# Altium schematic sheet IMU.SchDoc
size 420 x 297 mm; SheetNumber: 4; SheetTotal: 7
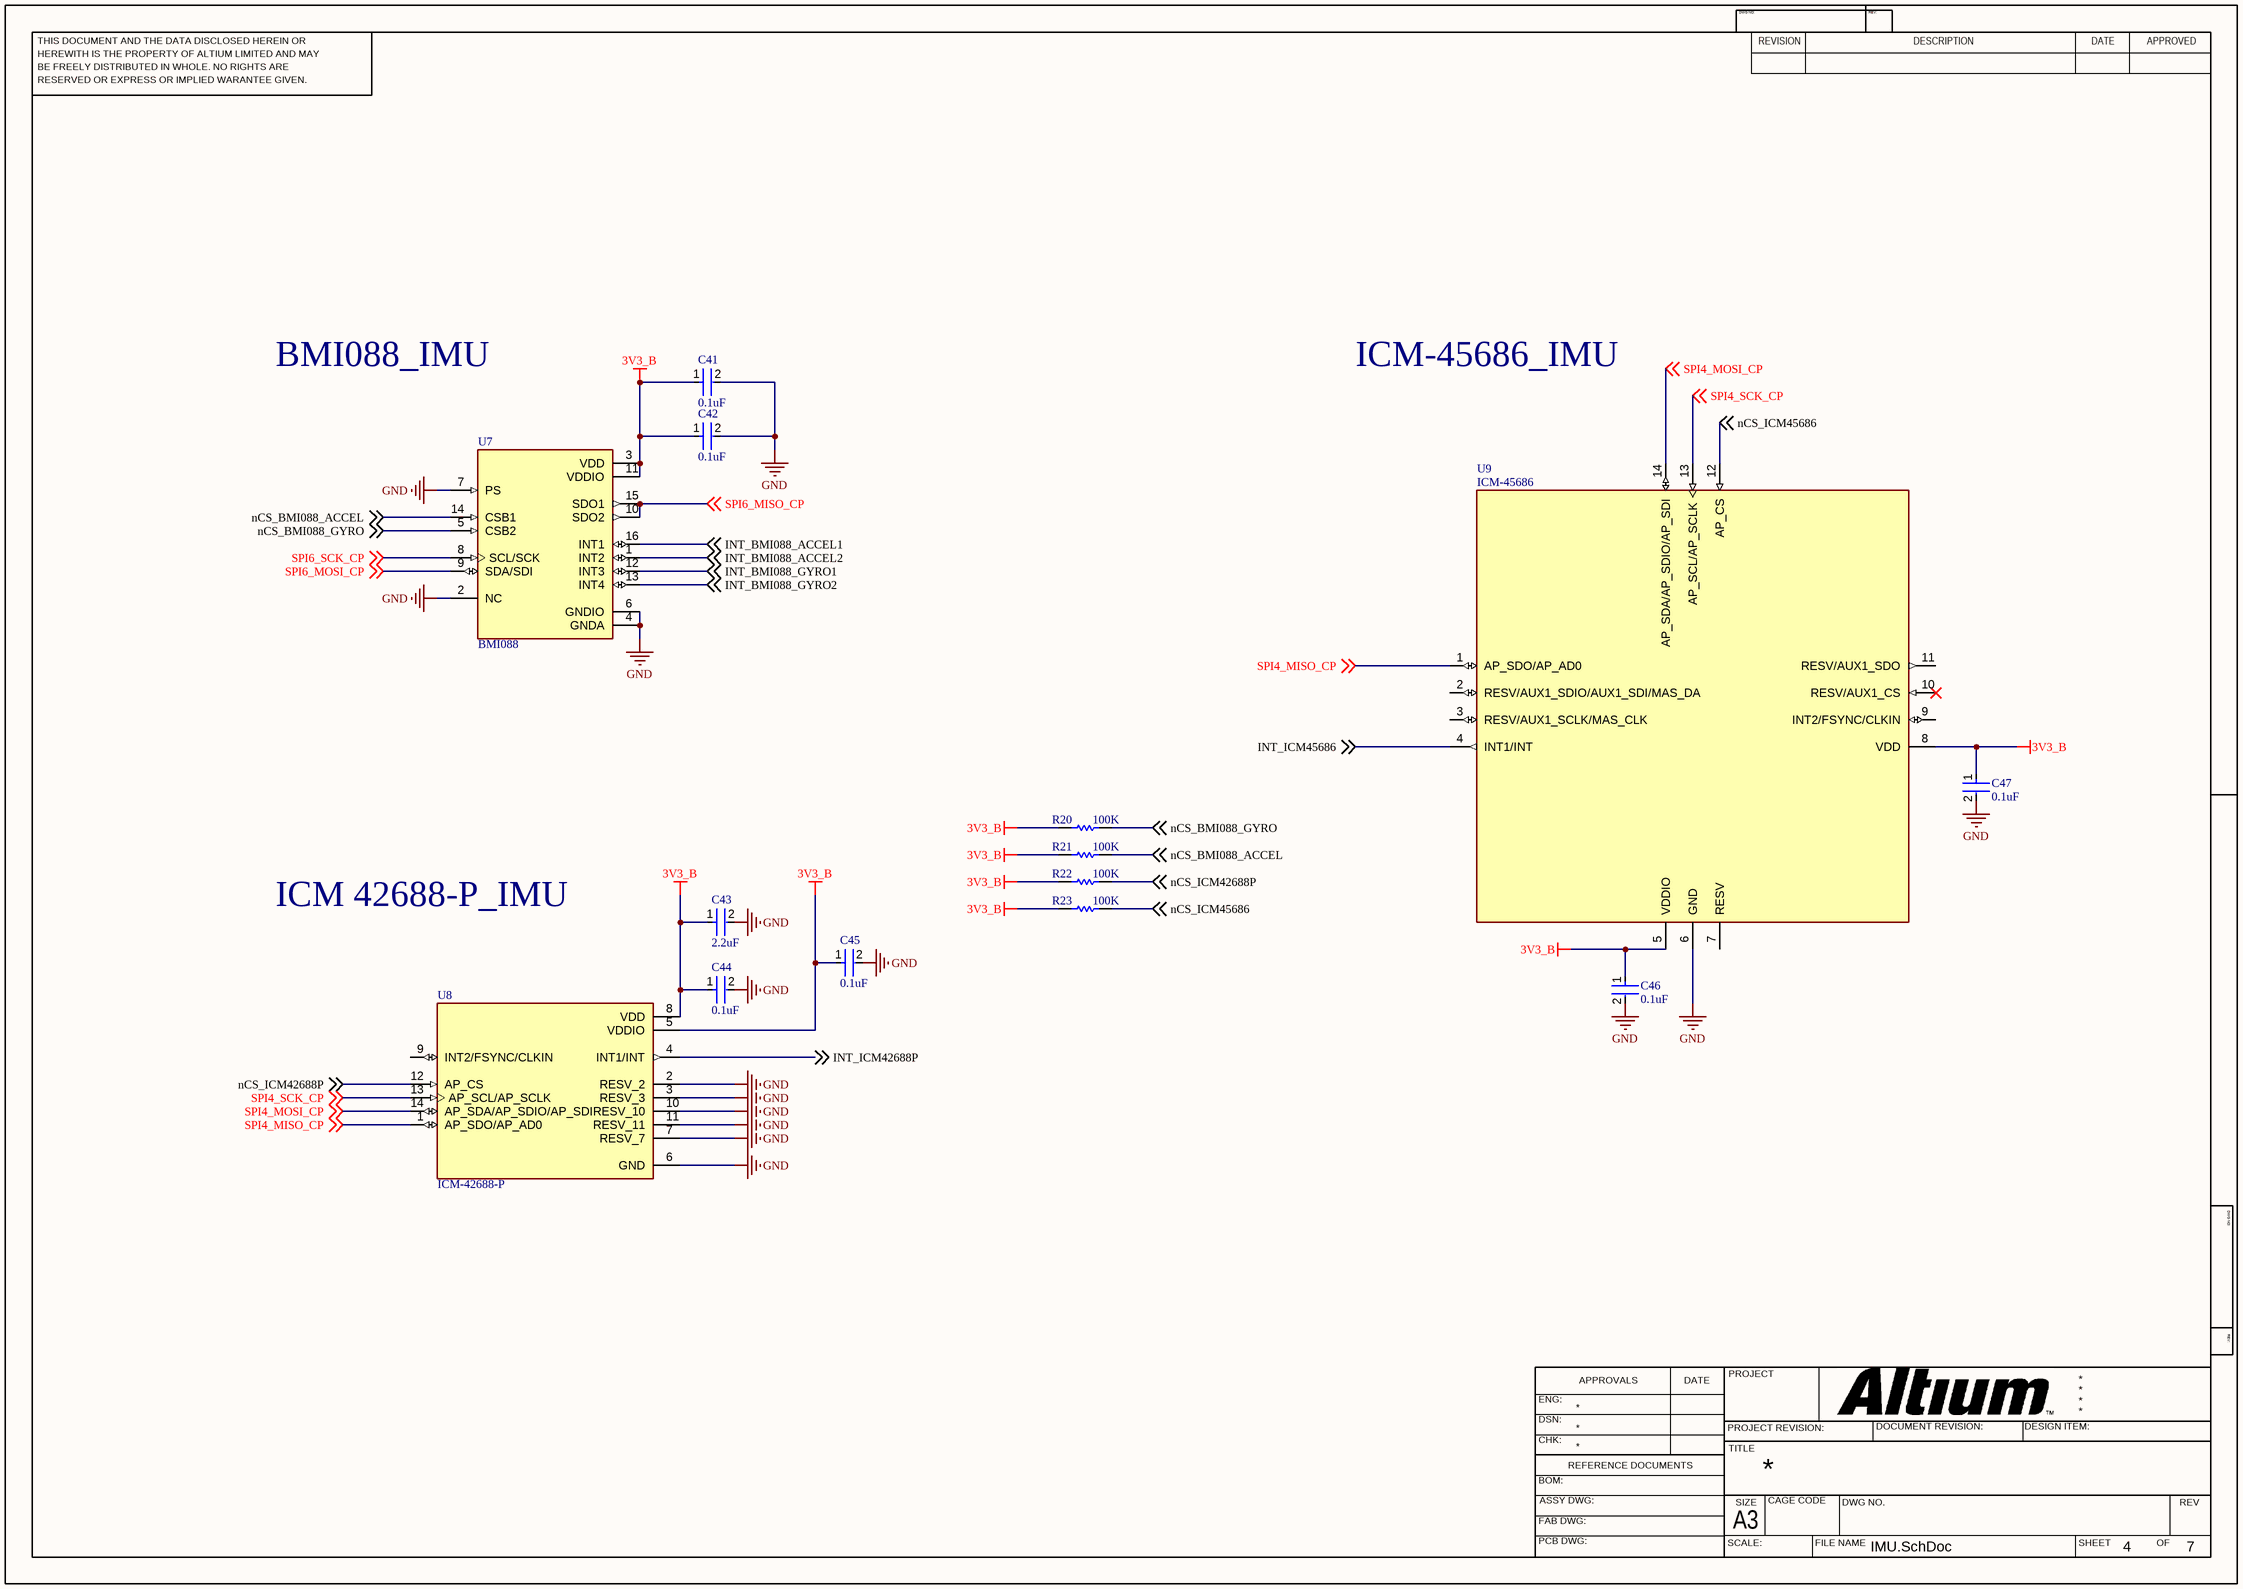
[diagram p0: IMU.SchDoc]

## Parts
C41  0.1uF  [FP-C0603C-CF-MFG]
C42  0.1uF  [FP-C0603C-CF-MFG]
C43  2.2uF  [FP-GRM188-0_1-e0_2_0_5-MFG]
C44  0.1uF  [FP-C0603C-CF-MFG]
C45  0.1uF  [FP-C0603C-CF-MFG]
C46  0.1uF  [FP-C0603C-CF-MFG]
C47  0.1uF  [FP-C0603C-CF-MFG]
R20  100K  [RESC1608X55X30ML20T10]
R21  100K  [RESC1608X55X30ML20T10]
R22  100K  [RESC1608X55X30ML20T10]
R23  100K  [RESC1608X55X30ML20T10]
U7  BMI088  [PQFN50P450X300X100-16N]
U8  ICM-42688-P  [PQFN50P300X250X97-14N]
U9  ICM-45686  [IC_ICM-45686]

## Nets
3V3_B: C41.1 C42.1 C43.1 C44.1 C45.1 C46.1 C47.1 R20.2 R21.2 R22.2 R23.2 U7.3(VDD) U7.11(VDDIO) U8.5(VDDIO) U8.8(VDD) U9.5(VDDIO) U9.8(VDD)
GND: C41.2 C42.2 C43.2 C44.2 C45.2 C46.2 C47.2 U7.2(NC) U7.4(GNDA) U7.6(GNDIO) U7.7(PS) U8.2(RESV_2) U8.3(RESV_3) U8.6(GND) U8.7(RESV_7) U8.10(RESV_10) U8.11(RESV_11) U9.6(GND)
INT_BMI088_ACCEL1: U7.16(INT1) ; off-sheet INT_BMI088_ACCEL1
INT_BMI088_ACCEL2: U7.1(INT2) ; off-sheet INT_BMI088_ACCEL2
INT_BMI088_GYRO1: U7.12(INT3) ; off-sheet INT_BMI088_GYRO1
INT_BMI088_GYRO2: U7.13(INT4) ; off-sheet INT_BMI088_GYRO2
INT_ICM42688P: U8.4(INT1/INT) ; off-sheet INT_ICM42688P
INT_ICM45686: U9.4(INT1/INT) ; off-sheet INT_ICM45686
nCS_BMI088_ACCEL: R21.1 U7.14(CSB1) ; off-sheet nCS_BMI088_ACCEL
nCS_BMI088_GYRO: R20.1 U7.5(CSB2) ; off-sheet nCS_BMI088_GYRO
nCS_ICM42688P: R22.1 U8.12(AP_CS) ; off-sheet nCS_ICM42688P
nCS_ICM45686: R23.1 U9.12(AP_CS) ; off-sheet nCS_ICM45686
SPI4_MISO_CP: U8.1(AP_SDO/AP_AD0) U9.1(AP_SDO/AP_AD0) ; off-sheet SPI4_MISO_CP
SPI4_MOSI_CP: U8.14(AP_SDA/AP_SDIO/AP_SDI) U9.14(AP_SDA/AP_SDIO/AP_SDI) ; off-sheet SPI4_MOSI_CP
SPI4_SCK_CP: U8.13(AP_SCL/AP_SCLK) U9.13(AP_SCL/AP_SCLK) ; off-sheet SPI4_SCK_CP
SPI6_MISO_CP: U7.10(SDO2) U7.15(SDO1) ; off-sheet SPI6_MISO_CP
SPI6_MOSI_CP: U7.9(SDA/SDI) ; off-sheet SPI6_MOSI_CP
SPI6_SCK_CP: U7.8(SCL/SCK) ; off-sheet SPI6_SCK_CP

Not connected (* = marked no-connect by the designer): U8 9(INT2/FSYNC/CLKIN); U9 2(RESV/AUX1_SDIO/AUX1_SDI/MAS_DA) 3(RESV/AUX1_SCLK/MAS_CLK) 7(RESV) 9(INT2/FSYNC/CLKIN) 10(RESV/AUX1_CS)* 11(RESV/AUX1_SDO)

## Notes on the sheet
- BMI088_IMU
- ICM-45686_IMU
- ICM 42688-P_IMU
- THIS DOCUMENT AND THE DATA DISCLOSED HEREIN OR
- HEREWITH IS THE PROPERTY OF ALTIUM LIMITED AND MAY
- DWG NO:
- REVISION
- REV:
- DESCRIPTION
- DATE
- APPROVED
- BE FREELY DISTRIBUTED IN WHOLE. NO RIGHTS ARE
- RESERVED OR EXPRESS OR IMPLIED WARANTEE GIVEN.
- ENG:
- APPROVALS
- PROJECT
- DSN:
- CHK:
- REFERENCE DOCUMENTS
- PROJECT REVISION:
- TITLE
- DOCUMENT REVISION:
- DESIGN ITEM:
- BOM:
- FAB DWG:
- PCB DWG:
- ASSY DWG:
- SCALE:
- A3
- SIZE
- CAGE CODE
- FILE NAME
- DWG NO.
- SHEET
- OF
- REV

## Library data of the parts
C41 C42 C44-C47 = CMP-2006-03061-2: CAP CER 0.1UF 50V X7R 0603; Manufacturer: KEMET; Manufacturer Part Number: C0603C104K5RACTU; Tolerance: 0.1; Temperature Coefficient: 30ppm/°C; Material: Ceramic; Automotive Grade: Grade 1; Value: 0.10 μF; Temperature: -55°C to +125°C; RoHS: TRUE; Temperature Range High: +125°C; Lead Free: Yes; Octopart: https://octopart.com/c0603c104k5ractu-kemet-139244; Digikey Description: CAP CER 0.1UF 50V X7R 0603; Category: Cap; Package: C0603C-CF; ComponentLink2Description: Datasheet; Temperature Range Low: -55°C; Device Class L1: Passive Components; Voltage Rating: 50 V; Automotive: Yes; Device Class L3: Ceramic Capacitors; ComponentLink2URL: https://api.kemet.com/component-edge/download/datasheet/C0603C100J5GACAUTO.pdf; Capacitance: 0.10 μF; Device Class L2: Capacitors; Temperature Characteristic: X7R; Height: 0.87mm
C43 = CMP-2006-02836-2: Chip Multilayer Ceramic Capacitors for General Purpose, 0603, 2.2uF, X7R, 15%, 10%, 10V; Case Code (Metric): 1608; Height: 0.8mm; Packaging: Cut Tape; Voltage: 10V; Lead Free: Lead Free; Min Operating Temperature: -55°C; Voltage Rating (DC): 10V; Max Operating Temperature: 125°C; Voltage Rating: 10V; Dielectric: X7R; Depth: 0.8mm; Case Code (Imperial): 0603; Termination: SMD/SMT; Case/Package: 0603; Number of Pins: 2; REACH SVHC: No SVHC; Mount: Surface Mount; Width: 0.031inch; Material: Ceramic; Capacitance: 2.2uF; Package Quantity: 1; Weight: 7.1E-05oz; Length: 1.6mm; Thickness: 0.035inch; Tolerance: 10%
R20-R23 = CMP-2000-01852-1: Part Number: RK73B1JTTD104J; Manufacturer: KOA Speer
U7 = CMP-010-00024-2: High-performance 6-axis inertial sensor (accelerometer + gyroscope) <a href="https://pricing.snapeda.com/parts/BMI088/Bosch%20Sensortec/view-part?ref=eda">Check prices</a>; Price: None; Pins: 16; Design Item ID: BMI088; Source: BMI088.SchLib; Component Type: Standard; Availability: Unavailable; Value: *; MP: BMI088; Case/Package: None
U8 = CMP-010-00026-2: Accelerometer, Gyroscope, 6 Axis Sensor Output; Availability: Unavailable; Component Type: Standard; Value: *; MP: ICM-42688-P; Design Item ID: ICM-42688-P; Case/Package: None; Source: ICM-42688-P.SchLib; Price: None; Pins: 14
U9 = CMP-010-00025-1: Accelerometer, Gyroscope, 6 Axis Sensor I2C, I3C, SPI Output; MF: TDK InvenSense; Design Item ID: ICM-45686; Component Type: Standard; Check_prices: https://www.snapeda.com/parts/ICM-45686/TDK+InvenSense/view-part/?ref=eda; Case/Package: Package; SnapEDA_Link: https://www.snapeda.com/parts/ICM-45686/TDK+InvenSense/view-part/?ref=snap; Pins: 14; Source: ICM-45686.SchLib; MP: ICM-45686; Value: *